# Altium schematic sheet TermSingleAndDiff.SchDoc
size A4; CompanyName: Technische Hochschule Nürnberg Georg Simon Ohm; Address1: Fürther Straße 250; Address2: 90429 Nürnberg; Address3: GERMANY; DocumentNumber: 13; SheetNumber: 13; SheetTotal: 16; CompanyName2: Institut ELSYS
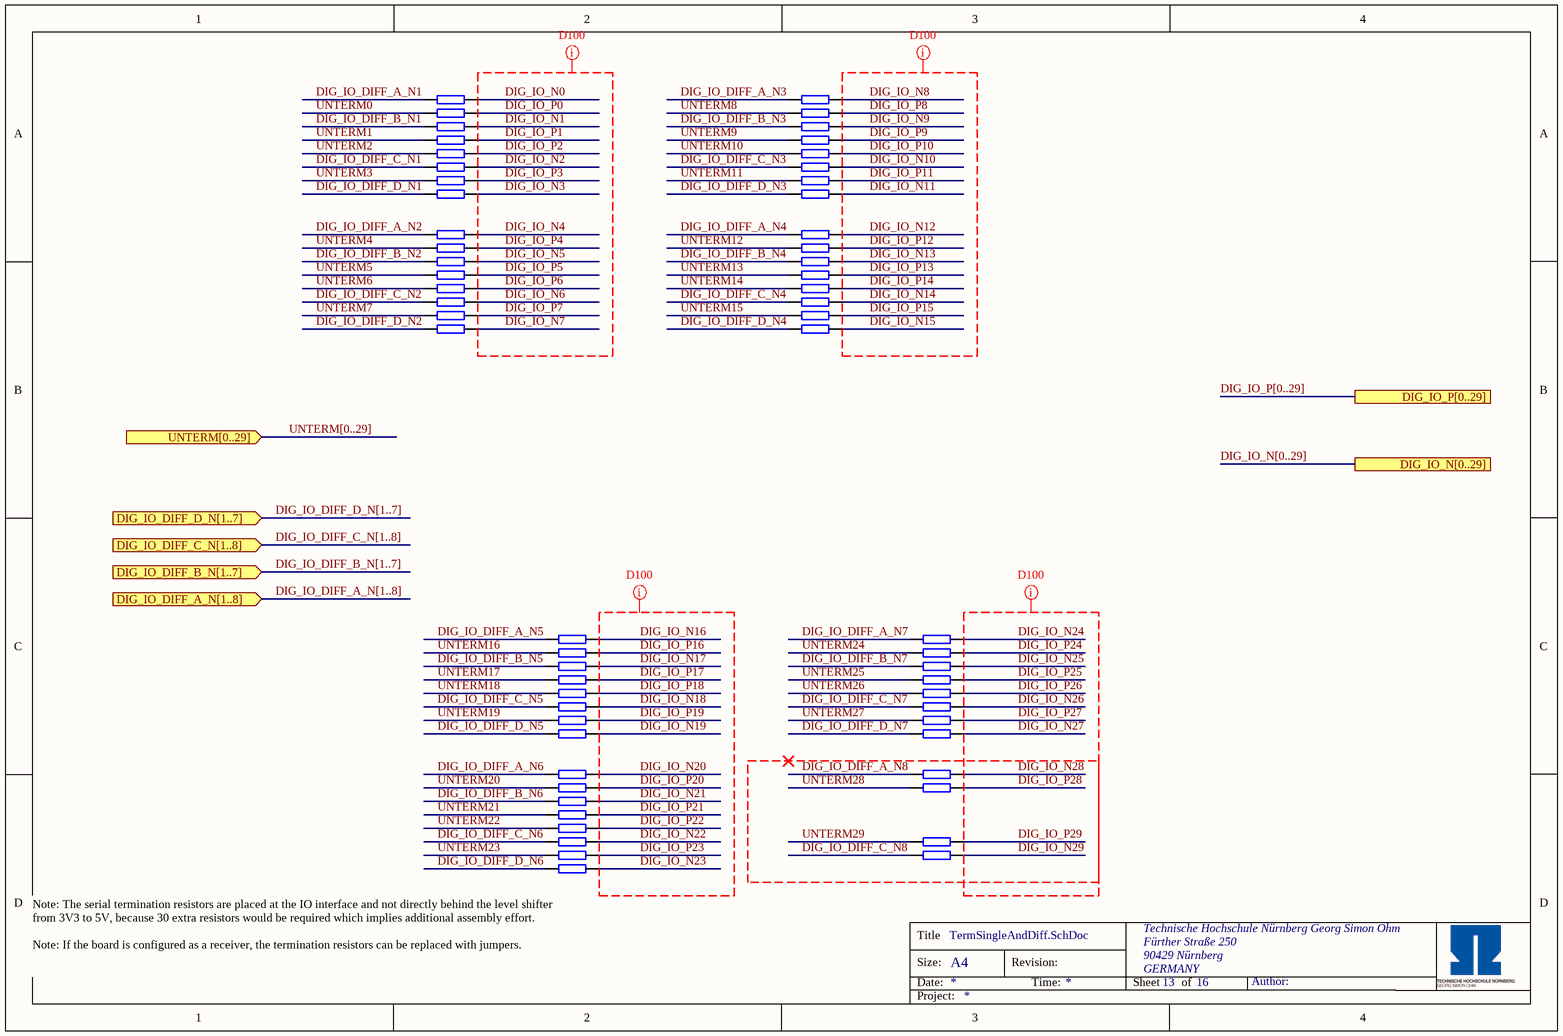
[diagram p0: TermSingleAndDiff.SchDoc]

## Parts
R81  47R  [RES 0603_1608]  (value not drawn)
R82  47R  [RES 0603_1608]  (value not drawn)
R83  47R  [RES 0603_1608]  (value not drawn)
R84  47R  [RES 0603_1608]  (value not drawn)
R85  47R  [RES 0603_1608]  (value not drawn)
R86  47R  [RES 0603_1608]  (value not drawn)
R87  47R  [RES 0603_1608]  (value not drawn)
R88  47R  [RES 0603_1608]  (value not drawn)
R89  47R  [RES 0603_1608]  (value not drawn)
R90  47R  [RES 0603_1608]  (value not drawn)
R91  47R  [RES 0603_1608]  (value not drawn)
R92  47R  [RES 0603_1608]  (value not drawn)
R93  47R  [RES 0603_1608]  (value not drawn)
R94  47R  [RES 0603_1608]  (value not drawn)
R95  47R  [RES 0603_1608]  (value not drawn)
R96  47R  [RES 0603_1608]  (value not drawn)
R97  47R  [RES 0603_1608]  (value not drawn)
R98  47R  [RES 0603_1608]  (value not drawn)
R99  47R  [RES 0603_1608]  (value not drawn)
R100  47R  [RES 0603_1608]  (value not drawn)
R101  47R  [RES 0603_1608]  (value not drawn)
R102  47R  [RES 0603_1608]  (value not drawn)
R103  47R  [RES 0603_1608]  (value not drawn)
R104  47R  [RES 0603_1608]  (value not drawn)
R105  47R  [RES 0603_1608]  (value not drawn)
R106  47R  [RES 0603_1608]  (value not drawn)
R107  47R  [RES 0603_1608]  (value not drawn)
R108  47R  [RES 0603_1608]  (value not drawn)
R109  47R  [RES 0603_1608]  (value not drawn)
R110  47R  [RES 0603_1608]  (value not drawn)
R111  47R  [RES 0603_1608]  (value not drawn)
R112  47R  [RES 0603_1608]  (value not drawn)
R113  47R  [RES 0603_1608]  (value not drawn)
R114  47R  [RES 0603_1608]  (value not drawn)
R115  47R  [RES 0603_1608]  (value not drawn)
R116  47R  [RES 0603_1608]  (value not drawn)
R117  47R  [RES 0603_1608]  (value not drawn)
R118  47R  [RES 0603_1608]  (value not drawn)
R119  47R  [RES 0603_1608]  (value not drawn)
R120  47R  [RES 0603_1608]  (value not drawn)
R121  47R  [RES 0603_1608]  (value not drawn)
R122  47R  [RES 0603_1608]  (value not drawn)
R123  47R  [RES 0603_1608]  (value not drawn)
R124  47R  [RES 0603_1608]  (value not drawn)
R125  47R  [RES 0603_1608]  (value not drawn)
R126  47R  [RES 0603_1608]  (value not drawn)
R127  47R  [RES 0603_1608]  (value not drawn)
R128  47R  [RES 0603_1608]  (value not drawn)
R129  47R  [RES 0603_1608]  (value not drawn)
R130  47R  [RES 0603_1608]  (value not drawn)
R131  47R  [RES 0603_1608]  (value not drawn)
R132  47R  [RES 0603_1608]  (value not drawn)
R133  47R  [RES 0603_1608]  (value not drawn)
R134  47R  [RES 0603_1608]  (value not drawn)
R135  47R  [RES 0603_1608]  (value not drawn)
R136  47R  [RES 0603_1608]  (value not drawn)
R137  47R  [RES 0603_1608]  (value not drawn)
R138  47R  [RES 0603_1608]  (value not drawn)
R139  47R  [RES 0603_1608]  (value not drawn)
R140  47R  [RES 0603_1608]  (value not drawn)

## Ports
DIG_IO_DIFF_A_N[1..8] (in), DIG_IO_DIFF_B_N[1..7] (in), DIG_IO_DIFF_C_N[1..8] (in), DIG_IO_DIFF_D_N[1..7] (in), DIG_IO_N[0..29], DIG_IO_P[0..29], UNTERM[0..29] (in)

## Nets
DIG_IO_DIFF_A_N1: R81.1
DIG_IO_DIFF_A_N2: R89.1
DIG_IO_DIFF_A_N3: R113.1
DIG_IO_DIFF_A_N4: R121.1
DIG_IO_DIFF_A_N5: R97.1
DIG_IO_DIFF_A_N6: R105.1
DIG_IO_DIFF_A_N7: R129.1
DIG_IO_DIFF_A_N8: R137.1
DIG_IO_DIFF_B_N1: R83.1
DIG_IO_DIFF_B_N2: R91.1
DIG_IO_DIFF_B_N3: R115.1
DIG_IO_DIFF_B_N4: R123.1
DIG_IO_DIFF_B_N5: R99.1
DIG_IO_DIFF_B_N6: R107.1
DIG_IO_DIFF_B_N7: R131.1
DIG_IO_DIFF_C_N1: R86.1
DIG_IO_DIFF_C_N2: R94.1
DIG_IO_DIFF_C_N3: R118.1
DIG_IO_DIFF_C_N4: R126.1
DIG_IO_DIFF_C_N5: R102.1
DIG_IO_DIFF_C_N6: R110.1
DIG_IO_DIFF_C_N7: R134.1
DIG_IO_DIFF_C_N8: R140.1
DIG_IO_DIFF_D_N1: R88.1
DIG_IO_DIFF_D_N2: R96.1
DIG_IO_DIFF_D_N3: R120.1
DIG_IO_DIFF_D_N4: R128.1
DIG_IO_DIFF_D_N5: R104.1
DIG_IO_DIFF_D_N6: R112.1
DIG_IO_DIFF_D_N7: R136.1
DIG_IO_N0: R81.2
DIG_IO_N1: R83.2
DIG_IO_N2: R86.2
DIG_IO_N3: R88.2
DIG_IO_N4: R89.2
DIG_IO_N5: R91.2
DIG_IO_N6: R94.2
DIG_IO_N7: R96.2
DIG_IO_N8: R113.2
DIG_IO_N9: R115.2
DIG_IO_N10: R118.2
DIG_IO_N11: R120.2
DIG_IO_N12: R121.2
DIG_IO_N13: R123.2
DIG_IO_N14: R126.2
DIG_IO_N15: R128.2
DIG_IO_N16: R97.2
DIG_IO_N17: R99.2
DIG_IO_N18: R102.2
DIG_IO_N19: R104.2
DIG_IO_N20: R105.2
DIG_IO_N21: R107.2
DIG_IO_N22: R110.2
DIG_IO_N23: R112.2
DIG_IO_N24: R129.2
DIG_IO_N25: R131.2
DIG_IO_N26: R134.2
DIG_IO_N27: R136.2
DIG_IO_N28: R137.2
DIG_IO_N29: R140.2
DIG_IO_P0: R82.2
DIG_IO_P1: R84.2
DIG_IO_P2: R85.2
DIG_IO_P3: R87.2
DIG_IO_P4: R90.2
DIG_IO_P5: R92.2
DIG_IO_P6: R93.2
DIG_IO_P7: R95.2
DIG_IO_P8: R114.2
DIG_IO_P9: R116.2
DIG_IO_P10: R117.2
DIG_IO_P11: R119.2
DIG_IO_P12: R122.2
DIG_IO_P13: R124.2
DIG_IO_P14: R125.2
DIG_IO_P15: R127.2
DIG_IO_P16: R98.2
DIG_IO_P17: R100.2
DIG_IO_P18: R101.2
DIG_IO_P19: R103.2
DIG_IO_P20: R106.2
DIG_IO_P21: R108.2
DIG_IO_P22: R109.2
DIG_IO_P23: R111.2
DIG_IO_P24: R130.2
DIG_IO_P25: R132.2
DIG_IO_P26: R133.2
DIG_IO_P27: R135.2
DIG_IO_P28: R138.2
DIG_IO_P29: R139.2
UNTERM0: R82.1
UNTERM1: R84.1
UNTERM2: R85.1
UNTERM3: R87.1
UNTERM4: R90.1
UNTERM5: R92.1
UNTERM6: R93.1
UNTERM7: R95.1
UNTERM8: R114.1
UNTERM9: R116.1
UNTERM10: R117.1
UNTERM11: R119.1
UNTERM12: R122.1
UNTERM13: R124.1
UNTERM14: R125.1
UNTERM15: R127.1
UNTERM16: R98.1
UNTERM17: R100.1
UNTERM18: R101.1
UNTERM19: R103.1
UNTERM20: R106.1
UNTERM21: R108.1
UNTERM22: R109.1
UNTERM23: R111.1
UNTERM24: R130.1
UNTERM25: R132.1
UNTERM26: R133.1
UNTERM27: R135.1
UNTERM28: R138.1
UNTERM29: R139.1

## Buses and harness runs
bus DIG_IO_DIFF_A_N[1..8] = port DIG_IO_DIFF_A_N[1..8]
bus DIG_IO_DIFF_B_N[1..7] = port DIG_IO_DIFF_B_N[1..7]
bus DIG_IO_DIFF_C_N[1..8] = port DIG_IO_DIFF_C_N[1..8]
bus DIG_IO_DIFF_D_N[1..7] = port DIG_IO_DIFF_D_N[1..7]
bus DIG_IO_N[0..29] = port DIG_IO_N[0..29]
bus DIG_IO_P[0..29] = port DIG_IO_P[0..29]
bus UNTERM[0..29] = port UNTERM[0..29]

## Layout directives
net class D100_alt: DIG_IO_N0, DIG_IO_N1, DIG_IO_N2, DIG_IO_N3, DIG_IO_N4, DIG_IO_N5, DIG_IO_N6, DIG_IO_N7, DIG_IO_N8, DIG_IO_N9, DIG_IO_N10, DIG_IO_N11, DIG_IO_N12, DIG_IO_N13, DIG_IO_N14, DIG_IO_N15, DIG_IO_N16, DIG_IO_N17, DIG_IO_N18, DIG_IO_N19, DIG_IO_N20, DIG_IO_N21, DIG_IO_N22, DIG_IO_N23, DIG_IO_N24, DIG_IO_N25, DIG_IO_N26, DIG_IO_N27, DIG_IO_N28, DIG_IO_N29, DIG_IO_P0, DIG_IO_P1, DIG_IO_P2, DIG_IO_P3, DIG_IO_P4, DIG_IO_P5, DIG_IO_P6, DIG_IO_P7, DIG_IO_P8, DIG_IO_P9, DIG_IO_P10, DIG_IO_P11, DIG_IO_P12, DIG_IO_P13, DIG_IO_P14, DIG_IO_P15, DIG_IO_P16, DIG_IO_P17, DIG_IO_P18, DIG_IO_P19, DIG_IO_P20, DIG_IO_P21, DIG_IO_P22, DIG_IO_P23, DIG_IO_P24, DIG_IO_P25, DIG_IO_P26, DIG_IO_P27, DIG_IO_P28, DIG_IO_P29

## Notes on the sheet
- Note: The serial termination resistors are placed at the IO interface and not directly behind the level shifter from 3V3 to 5V, because 30 extra resistors would be required which implies additional assembly effort.
  Note: If the board is configured as a receiver, the termination resistors can be replaced with jumpers.
- Title
- Size:
- Date:
- A4
- Revision:
- Time:
- Sheet
- of
- Author:
- Project:

## Library data of the parts
R81-R140 = RK73B1JTTDD470J: SMD resistor E24 series; Manufacturer: KOA Speer; Tolerance: 5%; Created from: MGremer; Manufacturer Part Number: RK73B1JTTDD470J; PartID: 42; Created On: 14.12.2020 16:17:14; ComponentLink1Description: Datasheet; ComponentLink1URL: https://www.mouser.de/datasheet/2/219/RK73B-1825463.pdf; Component Type: SMD resistor; Device Package: 0603; Last Updated: 04.03.2021 09:09:42; Mounting Type: SMD; Supplier 1: Mouser; Supplier Part Number 1: 660-RK73B1JTTDD470J; Supplier 2: LCSC; Supplier Part Number 2: C23182; Type: Resistor; Value: 47R; Live Cycle Status: 1; Stock number: Labor SMD Container; LCSC Part Number: C23182